# Altium project Voltage Regulator PCB.PrjPcb
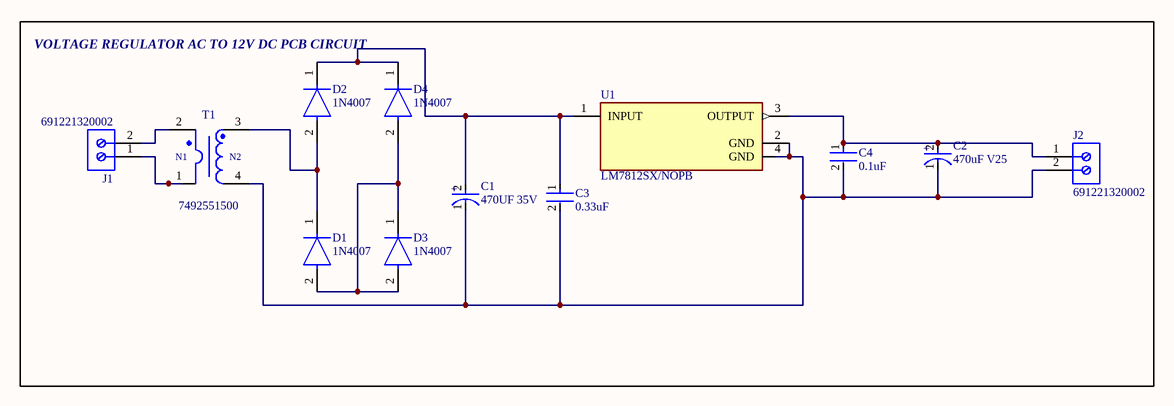
[diagram p0: VOLTAGE REGULATOR AC TO 12V DC PCB CIRCUIT.SchDoc]
1 sheet, 12 parts. Net scope: global (net labels, ports and power ports of the same name join across sheets).
Board file: VOLTAGE REGULATOR AC TO 12V DC PCB CIRCUIT.PcbDoc

## Sheet VOLTAGE REGULATOR AC TO 12V DC PCB CIRCUIT.SchDoc
size A4; SheetNumber: 1; SheetTotal: 1

### Parts
C1  470UF 35V  [FP-FKH13-MFG]
C2  470uF V25  [FP-477AVG025MFBJ-MFG]
C3  0.33uF  [FP-GCJ21B-0_3-IPC_C]
C4  0.1uF  [FP-GCG188-0_2-IPC_A]
D1  1N4007  [FP-1N4007-MFG]
D2  1N4007  [FP-1N4007-MFG]
D3  1N4007  [FP-1N4007-MFG]
D4  1N4007  [FP-1N4007-MFG]
J1  691221320002  [691221320002]
J2  691221320002  [691221320002]
T1  7492551500  [WE-CSTLF_EI187]
U1  LM7812SX/NOPB  [FP-KTT0003B-MFG]

### Blocks framed on the sheet
VOLTAGE REGULATOR AC TO 12V DC PCB CIRCUIT: C1-C4 D1-D4 J1 J2 T1 U1

### Nets
NetC1_1: C1.1(C) C2.1(C) C3.2 C4.2 J2.2 T1.4 U1.2(GND) U1.4(GND)
NetC1_2: C1.2(A) C3.1 D2.1(C) D4.1(C) U1.1(INPUT)
NetC2_2: C2.2(A) C4.1 J2.1 U1.3(OUTPUT)
NetD1_1: D1.1(C) D2.2(A) T1.3
NetD1_2: D1.2(A) D3.1(C) D3.2(A) D4.2(A)
NetJ1_1: J1.1 T1.1
NetJ1_2: J1.2 T1.2

### Notes on the sheet
- (in symbol CMP-00087-58146277-1) +
- (in symbol CMP-03913-148624224-1) N1; N2
- (in symbol CMP-05427-000043-1) +

### Library data of the parts
C1 = CMP-05427-000043-1: CAP ALUM 470UF 20% 35V SMD; Dissipation Factor: 0.12%; Leakage Current: 3uA; Impedance: 60mR; Life (Hours): 5000Hour; Material: Aluminium; Ripple Current: 1.1A; Capacitance: 470uF; Length: 13.5mm; Voltage Rating (DC): 35V; Case/Package: Radial; Height - Seated (Max): 0.531inch; Package Quantity: 200; Tolerance: 20%; RoHS Compliant: Yes; Termination: SMD/SMT; REACH SVHC: No SVHC; Packaging: Tape and Reel; Radiation Hardening: No; Width: 900um; Max Operating Temperature: 105°C; Height: 13.5mm; Mount: Surface Mount; Voltage: 35V; Contact Plating: Tin; ESR (Equivalent Series Resistance): 60mR; Diameter: 12.5mm; Construction: Cylindrical; Voltage Rating: 35V; Series: FK; Lead Free: Lead Free; Min Operating Temperature: -55°C; Ripple Current (AC): 1.1A
C2 = CMP-00087-58146277-1: 477AVG025MFBJ Cap Aluminum Polymer 470uF 25VDC 20% (8 X 12mm) Radial 3.5mm 0.018 Ohm 4250mA 2000h 125C; ESR (Equivalent Series Resistance): 18mΩ; Capacitance: 470µF; Voltage Rating: 25V; Dissipation Factor: 12%; Life (Hours): 1500hours; Ripple Current: 4.25A; Leakage Current: 2.35mA; NexarPartId: 58146277; Case/Package: Radial; Min Operating Temperature: -55°C; Max Operating Temperature: 125°C; RoHS: Non-Compliant; Voltage Rating (DC): 25V; Tolerance: 20%; Height: 13.5mm
C3 = CMP-06035-049969-1: Multilayer Ceramic Capacitors MLCC - SMD/SMT 0805 0.33uF 10%, 50VDC,  X7R 15%; Lead Free: Lead Free
C4 = CMP-06035-032904-1: AgPd Termination Conductive Glue Mounting Chip Multilayer Ceramic Capacitors for Automotive 0.1uF with 20% as tolerance, 50V X8R 15%, 0603 Package
D1-D4 = CMP-123542-000001-1: Rectifier diode 1000 V 1 A DO-41, ,; Manufacturer: Diotec; Max Surge Forward Current: 27A; Forward Current: 1A; Max Junction Temp: +175°C; Reverse Voltage: 1000V; Value: 15pF; Peak Reverse Current: 5uA; Category: Diode; Temperature Range Low: -50°C; Automotive: No; Temperature: -50°C to +175°C; Lead Free: Yes; ComponentLink2Description: Datasheet; Max Repetitive Reverse Voltage: 1000V; ComponentLink2URL: https://datasheet.octopart.com/1N4007-Diotec-datasheet-62346875.pdf; Manufacturer Part Number: 1N4007; Device Class L3: Rectifier Diodes; Height: 2.8mm; Octopart: https://octopart.com/1n4007-diotec-4040411; Package: 1N4007; Temperature Range High: +175°C; Device Class L1: Discrete Semiconductors; Device Class L2: Diodes; RoHS: TRUE; Capacitance: 15pF; Ipc Land Pattern Name: DIOAD888W100L520D280
J1 J2 = CMP-1502-02500-3: Terminal Block, 3.81MM Pitch, 55DEG, Rising Cage Clamp, 28-16AWG, 2 Pin
T1 = CMP-03913-148624224-1: Current Sense Transformer, 3.6H, Th Rohs Compliant: Yes
U1 = CMP-04917-000346-1: IC REG LIN 12V 1.5A DDPAK/TO263; Quiescent Current: 8mA; Dropout Voltage: 2V; Min Operating Temperature: 0°C; RoHS Compliant: Yes; Lead Free: Contains Lead; Case/Package: TO-263; Max Operating Temperature: 125°C